# EAGLE schematic STM32 control board (EAGLE 9.6.1)

## Sheet 1 of 2
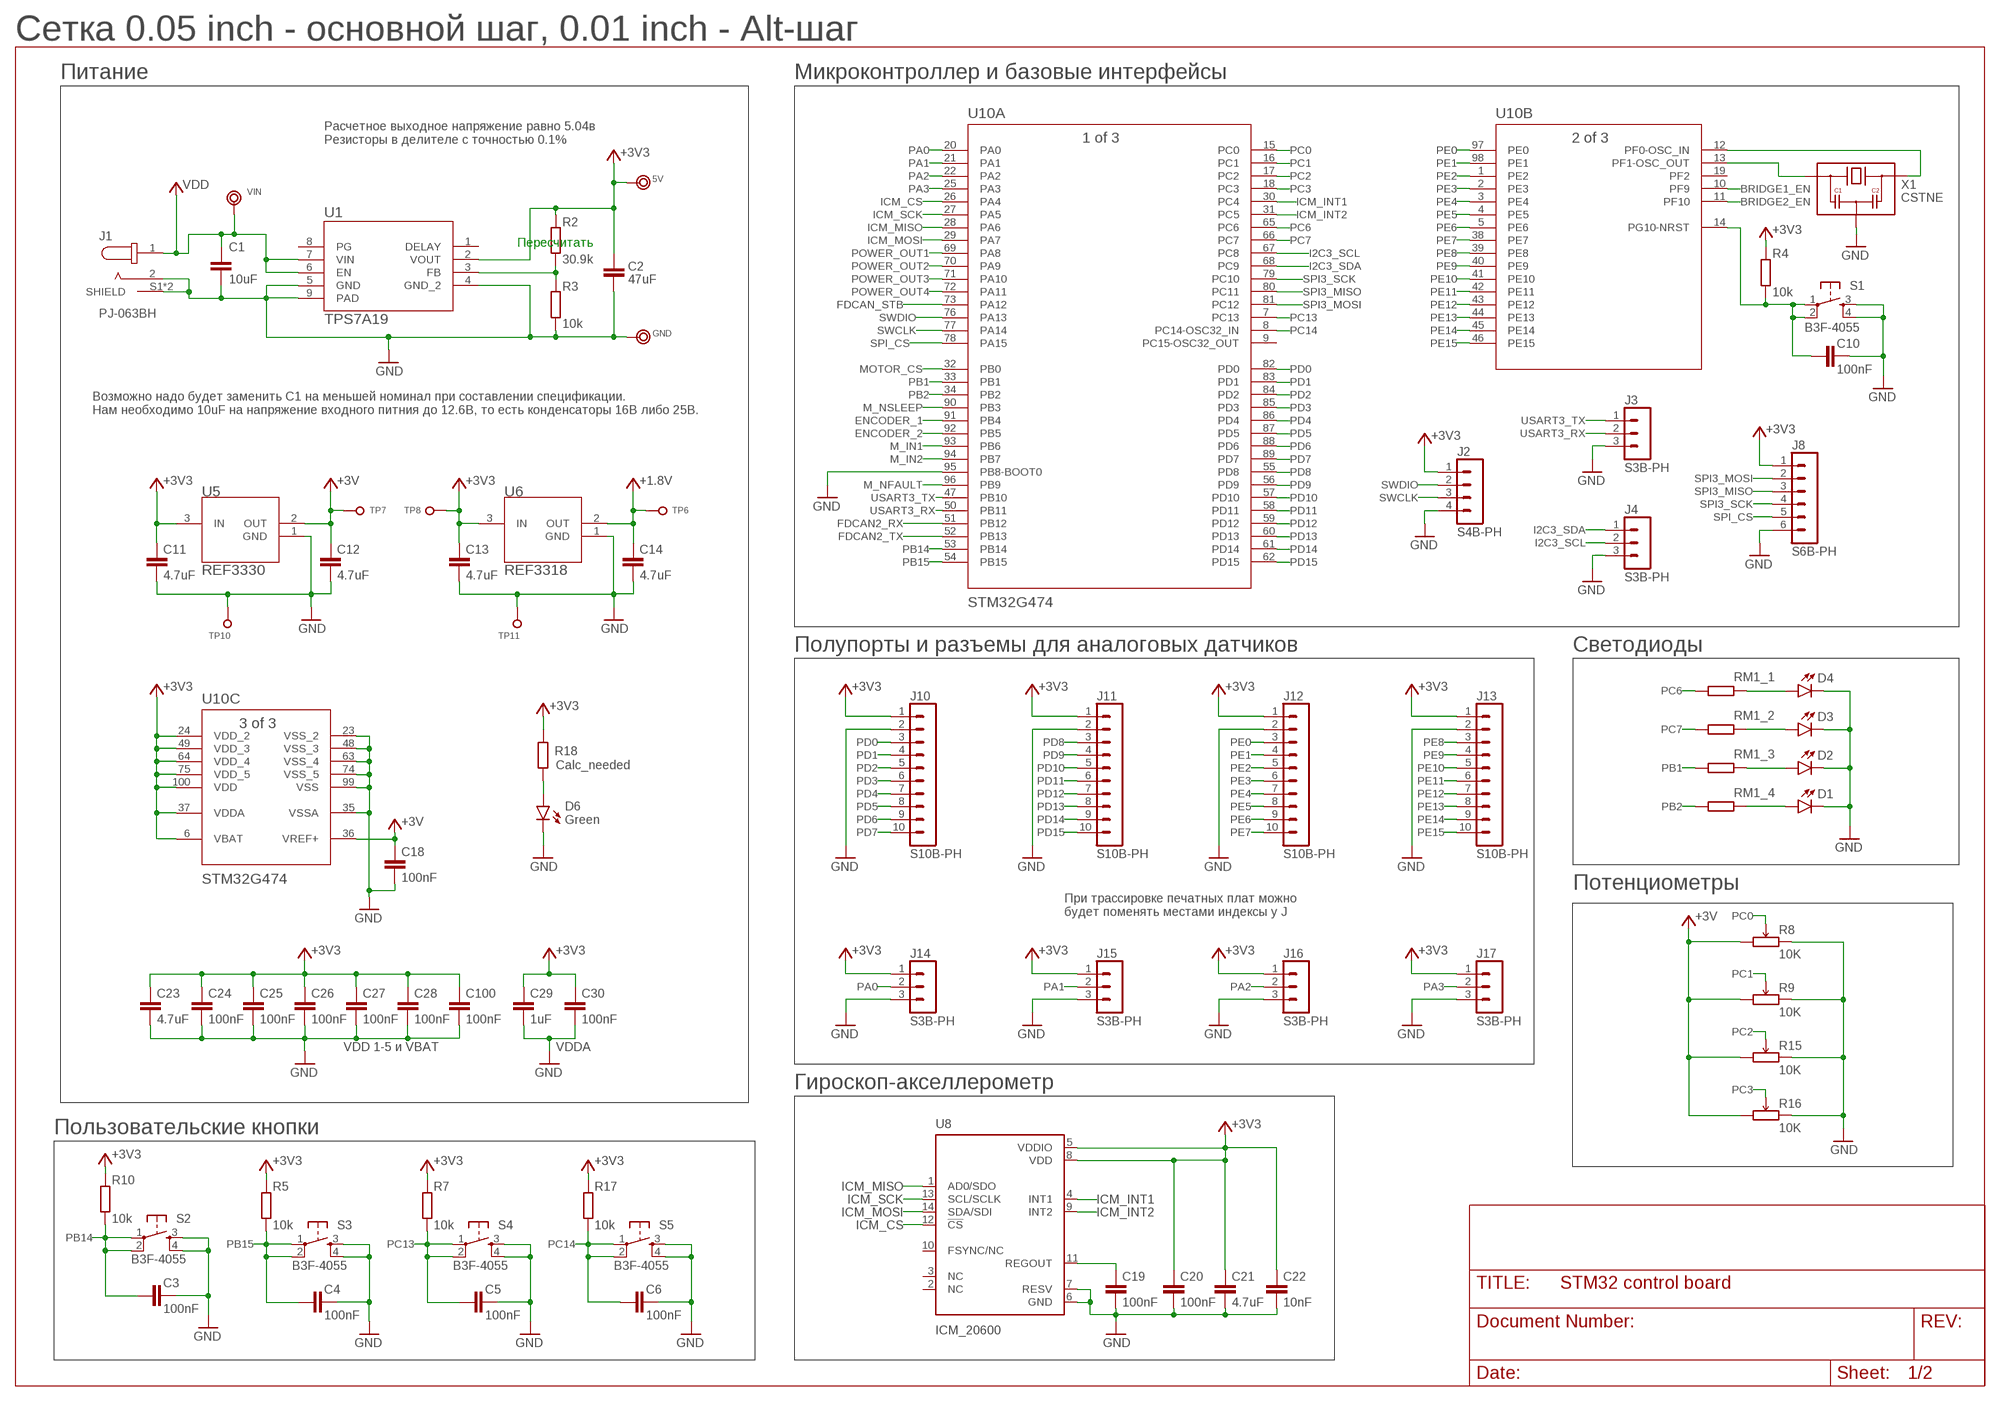
[diagram p0: schematic, sheet 1]

### Parts
5V  TEST_RING  [TEST_RING]
C1  10uF  C-EU-CERAMIC1206  [C1206]
C2  47uF  C-EU-CERAMIC1210  [C1210]
C3  100nF  C-EU-CERAMIC0402  [C0402]
C4  100nF  C-EU-CERAMIC0402  [C0402]
C5  100nF  C-EU-CERAMIC0402  [C0402]
C6  100nF  C-EU-CERAMIC0402  [C0402]
C10  100nF  C-EU-CERAMIC0402  [C0402]
C11  4.7uF  C-EU-CERAMIC0603  [C0603]
C12  4.7uF  C-EU-CERAMIC0603  [C0603]
C13  4.7uF  C-EU-CERAMIC0603  [C0603]
C14  4.7uF  C-EU-CERAMIC0603  [C0603]
C18  100nF  C-EU-CERAMIC0402  [C0402]
C19  100nF  C-EU-CERAMIC0402  [C0402]
C20  100nF  C-EU-CERAMIC0402  [C0402]
C21  4.7uF  C-EU-CERAMIC0603  [C0603]
C22  10nF  C-EU-CERAMIC0402  [C0402]
C23  4.7uF  C-EU-CERAMIC0603  [C0603]
C24  100nF  C-EU-CERAMIC0402  [C0402]
C25  100nF  C-EU-CERAMIC0402  [C0402]
C26  100nF  C-EU-CERAMIC0402  [C0402]
C27  100nF  C-EU-CERAMIC0402  [C0402]
C28  100nF  C-EU-CERAMIC0402  [C0402]
C29  1uF  C-EU-CERAMIC0402  [C0402]
C30  100nF  C-EU-CERAMIC0402  [C0402]
C100  100nF  C-EU-CERAMIC0402  [C0402]
D1  Blue  LED0805  [LED-0805]
D2  Blue  LED0805  [LED-0805]
D3  Blue  LED0805  [LED-0805]
D4  Blue  LED0805  [LED-0805]
D6  Green  LED0805  [LED-0805]
GND  TEST_RING  [TEST_RING]
J1  PJ-063BH  [CUI_PJ-063BH]
J2  S4B-PH  [S4B-PH-K]
J3  S3B-PH  [S3B-PH-K]
J4  S3B-PH  [S3B-PH-K]
J8  S6B-PH  [S6B-PH-K]
J10  S10B-PH  [S10B-PH-K]
J11  S10B-PH  [S10B-PH-K]
J12  S10B-PH  [S10B-PH-K]
J13  S10B-PH  [S10B-PH-K]
J14  S3B-PH  [S3B-PH-K]
J15  S3B-PH  [S3B-PH-K]
J16  S3B-PH  [S3B-PH-K]
J17  S3B-PH  [S3B-PH-K]
R2  30.9k  R-EU0402  [R0402]
R3  10k  R-EU0402  [R0402]
R4  10k  R-EU0402  [R0402]
R5  10k  R-EU0402  [R0402]
R7  10k  R-EU0402  [R0402]
R8  10K  POTEMTIOMETER_EU  [ALPS_PTM]
R9  10K  POTEMTIOMETER_EU  [ALPS_PTM]
R10  10k  R-EU0402  [R0402]
R15  10K  POTEMTIOMETER_EU  [ALPS_PTM]
R16  10K  POTEMTIOMETER_EU  [ALPS_PTM]
R17  10k  R-EU0402  [R0402]
R18  Calc_needed  R-EU0402  [R0402]
RM1  RES_ARRAY  [0603-ARC]
S1  B3F-4055  [SWITCH_B3F-4055]
S2  B3F-4055  [SWITCH_B3F-4055]
S3  B3F-4055  [SWITCH_B3F-4055]
S4  B3F-4055  [SWITCH_B3F-4055]
S5  B3F-4055  [SWITCH_B3F-4055]
TP6  1.8  TEST_PAD-[1.27MM_SK]  [TP1.27MM_MASK_SILKSCREEN]
TP7  3.0  TEST_PAD-[1.27MM_SK]  [TP1.27MM_MASK_SILKSCREEN]
TP8  3.3  TEST_PAD-[1.27MM_SK]  [TP1.27MM_MASK_SILKSCREEN]
TP10  TEST_PAD-[1.27MM_SK]  [TP1.27MM_MASK_SILKSCREEN]
TP11  TEST_PAD-[1.27MM_SK]  [TP1.27MM_MASK_SILKSCREEN]
U1  TPS7A19  TPS7A1901DRBT  [DRB0008B]
U5  REF3330  REF33  [SOT-23-3]
U6  REF3318  REF33  [SOT-23-3]
U8  ICM_20600  [14_PIN_LGA]
U10  STM32G474  STM32G4_LPQFP100  [LPQFP-100]
VIN  TEST_RING  [TEST_RING]
X1  CSTNE  [MURATA_SMD_3P]

### Nets
+1.8V: C14.1 TP6.1 U6.2(OUT) ; also sheet 2
+3V: C12.1 C18.1 R8.P$1 R9.P$1 R15.P$1 R16.P$1 TP7.1 U5.2(OUT) U10.36(C:VREF+)
+3V3: 5V.1 C2.1 C11.1 C13.1 C20.1 C21.1 C22.1 C23.1 C24.1 C25.1 C26.1 C27.1 C28.1 C29.1 C30.1 C100.1 J2.1 J8.1 J10.1 J11.1 J12.1 J13.1 J14.1 J15.1 J16.1 J17.1 R2.2 R4.1 R5.2 R7.2 R10.2 R17.2 R18.2 TP8.1 U1.2(VOUT) U5.3(IN) U6.3(IN) U8.5(VDDIO) U8.8(VDD) U10.6(C:VBAT) U10.24(C:VDD_2) U10.37(C:VDDA) U10.49(C:VDD_3) U10.64(C:VDD_4) U10.75(C:VDD_5) U10.100(C:VDD) ; also sheet 2
BRIDGE1_EN: U10.10(B:PF9) ; also sheet 2
BRIDGE2_EN: U10.11(B:PF10) ; also sheet 2
ENCODER_1: U10.91(A:PB4) ; also sheet 2
ENCODER_2: U10.92(A:PB5) ; also sheet 2
FDCAN2_RX: U10.51(A:PB12)
FDCAN2_TX: U10.52(A:PB13)
FDCAN_STB: U10.73(A:PA12)
GND: C1.2 C2.2 C3.2 C4.2 C5.2 C6.2 C10.2 C11.2 C12.2 C13.2 C14.2 C18.2 C19.2 C20.2 C21.2 C22.2 C23.2 C24.2 C25.2 C26.2 C27.2 C28.2 C29.2 C30.2 C100.2 D1.-(C) D2.-(C) D3.-(C) D4.-(C) D6.-(C) GND.1 J1.2 J1.S1(SHIELD) J1.S2(SHIELD) J2.4 J3.3 J4.3 J8.6 J10.2 J11.2 J12.2 J13.2 J14.3 J15.3 J16.3 J17.3 R3.1 R8.P$3 R9.P$3 R15.P$3 R16.P$3 S1.3 S1.4 S2.3 S2.4 S3.3 S3.4 S4.3 S4.4 S5.3 S5.4 TP10.1 TP11.1 U1.4(GND_2) U1.5(GND) U1.9(PAD) U5.1(GND) U6.1(GND) U8.6(GND) U8.7(RESV) U10.23(C:VSS_2) U10.35(C:VSSA) U10.48(C:VSS_3) U10.63(C:VSS_4) U10.74(C:VSS_5) U10.95(A:PB8-BOOT0) U10.99(C:VSS) X1.2(GND) ; also sheet 2
I2C3_SCL: J4.2 U10.67(A:PC8)
I2C3_SDA: J4.1 U10.68(A:PC9)
ICM_CS [ICM20600]: U8.12(!CS) U10.26(A:PA4)
ICM_INT1 [ICM20600]: U8.4(INT1) U10.30(A:PC4)
ICM_INT2 [ICM20600]: U8.9(INT2) U10.31(A:PC5)
ICM_MISO [ICM20600]: U8.1(AD0/SDO) U10.28(A:PA6)
ICM_MOSI [ICM20600]: U8.14(SDA/SDI) U10.29(A:PA7)
ICM_SCK [ICM20600]: U8.13(SCL/SCLK) U10.27(A:PA5)
M_IN1: U10.93(A:PB6) ; also sheet 2
M_IN2: U10.94(A:PB7) ; also sheet 2
M_NFAULT: U10.96(A:PB9) ; also sheet 2
M_NSLEEP: U10.90(A:PB3) ; also sheet 2
MOTOR_CS: U10.32(A:PB0) ; also sheet 2
N$1: U10.12(B:PF0-OSC_IN) X1.3(OUT)
N$2: U10.13(B:PF1-OSC_OUT) X1.1(IN)
N$4: D1.+(A) RM1.5
N$5: D2.+(A) RM1.6
N$6: D3.+(A) RM1.7
N$7: D6.+(A) R18.1
N$11: D4.+(A) RM1.8
N$21: R2.1 R3.2 U1.3(FB)
PA0: J14.2 U10.20(A:PA0)
PA1: J15.2 U10.21(A:PA1)
PA2: J16.2 U10.22(A:PA2)
PA3: J17.2 U10.25(A:PA3)
PB1: RM1.3 U10.33(A:PB1)
PB2: RM1.4 U10.34(A:PB2)
PB14: C3.1 R10.1 S2.1 S2.2 U10.53(A:PB14)
PB15: C4.1 R5.1 S3.1 S3.2 U10.54(A:PB15)
PC0: R8.P$2 U10.15(A:PC0)
PC1: R9.P$2 U10.16(A:PC1)
PC2: R15.P$2 U10.17(A:PC2)
PC3: R16.P$2 U10.18(A:PC3)
PC6: RM1.1 U10.65(A:PC6)
PC7: RM1.2 U10.66(A:PC7)
PC13: C5.1 R7.1 S4.1 S4.2 U10.7(A:PC13)
PC14: C6.1 R17.1 S5.1 S5.2 U10.8(A:PC14-OSC32_IN)
PD0: J10.3 U10.82(A:PD0)
PD1: J10.4 U10.83(A:PD1)
PD2: J10.5 U10.84(A:PD2)
PD3: J10.6 U10.85(A:PD3)
PD4: J10.7 U10.86(A:PD4)
PD5: J10.8 U10.87(A:PD5)
PD6: J10.9 U10.88(A:PD6)
PD7: J10.10 U10.89(A:PD7)
PD8: J11.3 U10.55(A:PD8)
PD9: J11.4 U10.56(A:PD9)
PD10: J11.5 U10.57(A:PD10)
PD11: J11.6 U10.58(A:PD11)
PD12: J11.7 U10.59(A:PD12)
PD13: J11.8 U10.60(A:PD13)
PD14: J11.9 U10.61(A:PD14)
PD15: J11.10 U10.62(A:PD15)
PE0: J12.3 U10.97(B:PE0)
PE1: J12.4 U10.98(B:PE1)
PE2: J12.5 U10.1(B:PE2)
PE3: J12.6 U10.2(B:PE3)
PE4: J12.7 U10.3(B:PE4)
PE5: J12.8 U10.4(B:PE5)
PE6: J12.9 U10.5(B:PE6)
PE7: J12.10 U10.38(B:PE7)
PE8: J13.3 U10.39(B:PE8)
PE9: J13.4 U10.40(B:PE9)
PE10: J13.5 U10.41(B:PE10)
PE11: J13.6 U10.42(B:PE11)
PE12: J13.7 U10.43(B:PE12)
PE13: J13.8 U10.44(B:PE13)
PE14: J13.9 U10.45(B:PE14)
PE15: J13.10 U10.46(B:PE15)
POWER_OUT1: U10.69(A:PA8) ; also sheet 2
POWER_OUT2: U10.70(A:PA9) ; also sheet 2
POWER_OUT3: U10.71(A:PA10) ; also sheet 2
POWER_OUT4: U10.72(A:PA11) ; also sheet 2
REG: C19.1 U8.11(REGOUT)
RST: C10.1 R4.2 S1.1 S1.2 U10.14(B:PG10-NRST)
SPI3_MISO: J8.3 U10.80(A:PC11)
SPI3_MOSI: J8.2 U10.81(A:PC12)
SPI3_SCK: J8.4 U10.79(A:PC10)
SPI_CS: J8.5 U10.78(A:PA15)
SWCLK: J2.3 U10.77(A:PA14)
SWDIO: J2.2 U10.76(A:PA13)
USART3_RX: J3.2 U10.50(A:PB11)
USART3_TX: J3.1 U10.47(A:PB10)
VDD: C1.1 J1.1 U1.6(EN) U1.7(VIN) VIN.1 ; also sheet 2
Unconnected: U1.1(DELAY) U1.8(PG) U8.2(NC) U8.3(NC) U8.10(FSYNC/NC) U10.9(A:PC15-OSC32_OUT) U10.19(B:PF2)

### Notes on the sheet
- Сетка 0.05 inch - основной шаг, 0.01 inch - Alt-шаг
- Питание | Микроконтроллер и базовые интерфейсы
- Расчетное выходное напряжение равно 5.04в
  Резисторы в делителе с точностью 0.1%
- Пересчитать
- Возможно надо будет заменить С1 на меньшей номинал при составлении спецификации. 
  Нам необходимо 10uF на напряжение входного питния до 12.6В, то есть конденсаторы 16В либо 25В.
- Полупорты и разъемы для аналоговых датчиков | Светодиоды
- Потенциометры
- При трассировке печатных плат можно
  будет поменять местами индексы у J
- VDD 1-5 и VBAT | VDDA
- Гироскоп-акселлерометр
- Пользовательские кнопки

## Sheet 2 of 2
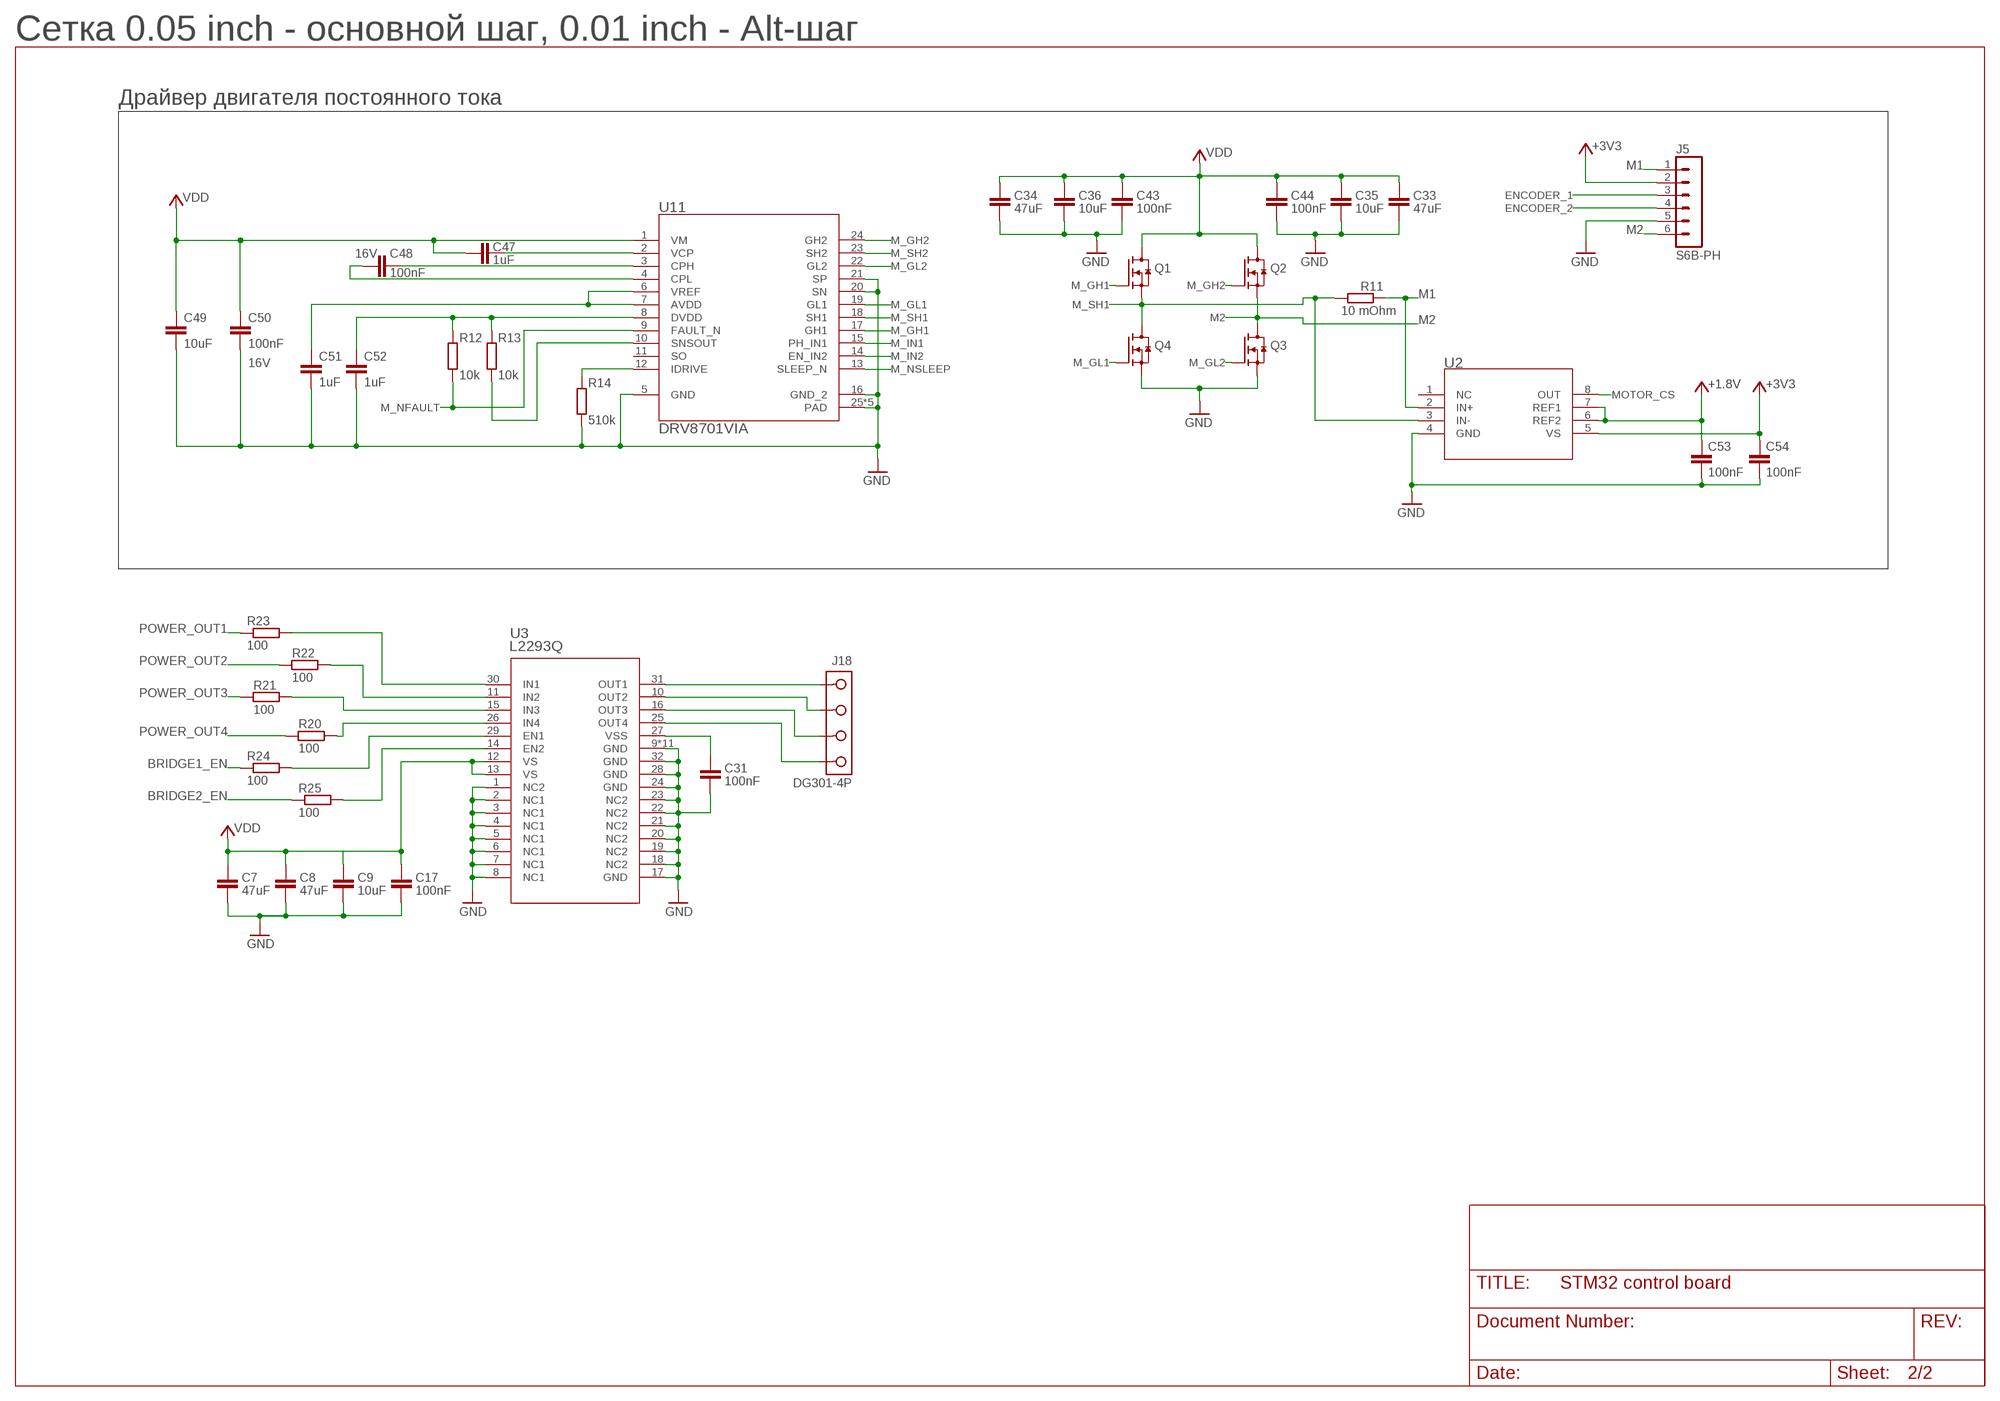
[diagram p1: schematic, sheet 2]

### Parts
C7  47uF  C-EU-CERAMIC1210  [C1210]
C8  47uF  C-EU-CERAMIC1210  [C1210]
C9  10uF  C-EU-CERAMIC1206  [C1206]
C17  100nF  C-EU-CERAMIC0402  [C0402]
C31  100nF  C-EU-CERAMIC0402  [C0402]
C33  47uF  C-EU-CERAMIC1210  [C1210]
C34  47uF  C-EU-CERAMIC1210  [C1210]
C35  10uF  C-EU-CERAMIC1206  [C1206]
C36  10uF  C-EU-CERAMIC1206  [C1206]
C43  100nF  C-EU-CERAMIC0603  [C0603]
C44  100nF  C-EU-CERAMIC0603  [C0603]
C47  1uF  C-EU-CERAMIC0603  [C0603]
C48  100nF  C-EU-CERAMIC0603  [C0603]
C49  10uF  C-EU-CERAMIC1206  [C1206]
C50  100nF  C-EU-CERAMIC0603  [C0603]
C51  1uF  C-EU-CERAMIC0402  [C0402]
C52  1uF  C-EU-CERAMIC0402  [C0402]
C53  100nF  C-EU-CERAMIC0402  [C0402]
C54  100nF  C-EU-CERAMIC0402  [C0402]
J5  S6B-PH  [S6B-PH-K]
J18  DG301-4P  [DG301-4P]
Q1  CSD15571Q2  [SON2X2]
Q2  CSD15571Q2  [SON2X2]
Q3  CSD15571Q2  [SON2X2]
Q4  CSD15571Q2  [SON2X2]
R11  10 mOhm  R_EU_CS  [CS_R0805]
R12  10k  R-EU0402  [R0402]
R13  10k  R-EU0402  [R0402]
R14  510k  R-EU0402  [R0402]
R20  100  R-EU0402  [R0402]
R21  100  R-EU0402  [R0402]
R22  100  R-EU0402  [R0402]
R23  100  R-EU0402  [R0402]
R24  100  R-EU0402  [R0402]
R25  100  R-EU0402  [R0402]
U2  INA240_TSSOP  [TSSOP-8]
U3  L2293Q  [QFN_293Q_STM]
U11  DRV8701VIA  [VQFN-24-VIA]

### Nets
+1.8V: C53.1 U2.6(REF2) U2.7(REF1) ; also sheet 1
+3V3: C54.1 J5.2 U2.5(VS) ; also sheet 1
AVDD1: C51.2 U11.6(VREF) U11.7(AVDD)
BRIDGE1_EN: R24.1 ; also sheet 1
BRIDGE2_EN: R25.1 ; also sheet 1
DRV2_SNSOUT: R13.1 U11.10(SNSOUT)
DVDD2: C52.2 R12.2 R13.2 U11.8(DVDD)
ENCODER_1: J5.3 ; also sheet 1
ENCODER_2: J5.4 ; also sheet 1
GND: C7.2 C8.2 C9.2 C17.2 C31.2 C33.2 C34.2 C35.2 C36.2 C43.2 C44.2 C49.2 C50.2 C51.1 C52.1 C53.2 C54.2 J5.5 Q3.S4(S) Q3.S8(S) Q4.S4(S) Q4.S8(S) R14.1 U2.4(GND) U3.1(NC2) U3.2(NC1) U3.3(NC1) U3.4(NC1) U3.5(NC1) U3.6(NC1) U3.7(NC1) U3.8(NC1) U3.9(GND) U3.17(GND) U3.18(NC2) U3.19(NC2) U3.20(NC2) U3.21(NC2) U3.22(NC2) U3.23(NC2) U3.24(GND) U3.28(GND) U3.32(GND) U3.P$1(GND) U3.P$2(GND) U3.P$3(GND) U3.P$4(GND) U3.P$5(GND) U3.P$6(GND) U3.P$7(GND) U3.P$8(GND) U3.P$9(GND) U3.PAD(GND) U11.5(GND) U11.16(GND_2) U11.20(SN) U11.21(SP) U11.25(PAD) U11.26(PAD) U11.27(PAD) U11.28(PAD) U11.29(PAD) ; also sheet 1
M1: J5.1 R11.2 U2.2(IN+)
M2: J5.6 Q2.S4(S) Q2.S8(S) Q3.D1(D) Q3.D2(D) Q3.D5(D) Q3.D6(D) Q3.D7(D)
M_GH1: Q1.G3(G) U11.17(GH1)
M_GH2: Q2.G3(G) U11.24(GH2)
M_GL1: Q4.G3(G) U11.19(GL1)
M_GL2: Q3.G3(G) U11.22(GL2)
M_IN1: U11.15(PH_IN1) ; also sheet 1
M_IN2: U11.14(EN_IN2) ; also sheet 1
M_NFAULT: R12.1 U11.9(FAULT_N) ; also sheet 1
M_NSLEEP: U11.13(SLEEP_N) ; also sheet 1
M_SH1: Q1.S4(S) Q1.S8(S) Q4.D1(D) Q4.D2(D) Q4.D5(D) Q4.D6(D) Q4.D7(D) R11.1 U2.3(IN-) U11.18(SH1)
M_SH2: U11.23(SH2)
MOTOR_CS: U2.8(OUT) ; also sheet 1
N$8: R23.2 U3.30(IN1)
N$15: R22.2 U3.11(IN2)
N$16: R21.2 U3.15(IN3)
N$17: C31.1 U3.27(VSS)
N$18: R20.2 U3.26(IN4)
N$19: R24.2 U3.29(EN1)
N$20: R25.2 U3.14(EN2)
N$24: C48.1 U11.3(CPH)
N$32: C48.2 U11.4(CPL)
N$33: C47.2 U11.2(VCP)
N$37: R14.2 U11.12(IDRIVE)
POUT1: J18.1 U3.31(OUT1)
POUT2: J18.2 U3.10(OUT2)
POUT3: J18.3 U3.16(OUT3)
POUT4: J18.4 U3.25(OUT4)
POWER_OUT1: R23.1 ; also sheet 1
POWER_OUT2: R22.1 ; also sheet 1
POWER_OUT3: R21.1 ; also sheet 1
POWER_OUT4: R20.1 ; also sheet 1
VDD: C7.1 C8.1 C9.1 C17.1 C33.1 C34.1 C35.1 C36.1 C43.1 C44.1 C47.1 C49.1 C50.1 Q1.D1(D) Q1.D2(D) Q1.D5(D) Q1.D6(D) Q1.D7(D) Q2.D1(D) Q2.D2(D) Q2.D5(D) Q2.D6(D) Q2.D7(D) U3.12(VS) U3.13(VS) U11.1(VM) ; also sheet 1
Unconnected: U2.1(NC) U11.11(SO)

### Notes on the sheet
- Сетка 0.05 inch - основной шаг, 0.01 inch - Alt-шаг
- Драйвер двигателя постоянного тока
- 16V
- 16V

## Library data of the parts
5V GND VIN = testing:TEST_RING: Test rings are used to fixing multimeter probe and doing measurements hands-free Updated: 02.01.2020 by Denis Yaskevich, denis.jaskevich@yandex.by
C1 C3-C6 C10-C14 C17-C31 C43 C44 C47-C54 C100 = Capacitors:C-EU-CERAMIC: MLCC footprints for reflow soldering According to https://docs.google.com/document/d/1dteNWmS3K0-mGsqeLvja9cdOfhO5witaUV6Y-umTd90/edit?usp=sharing Last edit 23.05.2020 by Denis Yaskevich, denis.jaskevich@yandex.by
C2 C7 C8 C33 C34 = Capacitors:C-EU-CERAMIC: MLCC footprints for reflow soldering According to https://docs.google.com/document/d/1dteNWmS3K0-mGsqeLvja9cdOfhO5witaUV6Y-umTd90/edit?usp=sharing Last edit 23.05.2020 by Denis Yaskevich, denis.jaskevich@yandex.by; MANUFACTURER_PART_NUMBER: GRM32ER61C476ME15L
C9 C35 C36 = Capacitors:C-EU-CERAMIC: MLCC footprints for reflow soldering According to https://docs.google.com/document/d/1dteNWmS3K0-mGsqeLvja9cdOfhO5witaUV6Y-umTd90/edit?usp=sharing Last edit 23.05.2020 by Denis Yaskevich, denis.jaskevich@yandex.by; MANUFACTURER_PART_NUMBER: CL31B106KOHNNNE
D1-D4 D6 = Semiconductor_devices:LED0805: LED Model suitable for all 0805 leds Updated: 22.10.19 by Andrey Dovnar, andrevdovnar@gmail.com
J1 = commonly used connectors:PJ-063BH: 2.5 mm Center Pin, 8.0 A, Right Angle, Through Hole, Shielded, Kinked Pins, Dc Power Jack Connector; MANUFACTURER: CUI INC; PARTREV: 1.02; STANDARD: Manufacturer recommendations
J2 = con-jst-ph:S4B-PH: Wire to board connector Model suitable for S4B-PH-K Updated: 21.10.19 by Andrey Dovnar, andrevdovnar@gmail.com
J3 J4 J14-J17 = con-jst-ph:S3B-PH: Wire to board connector Model suitable for S3B-PH-K Updated: 21.10.19 by Andrey Dovnar, andrevdovnar@gmail.com
J5 J8 = con-jst-ph:S6B-PH: Wire to board connector Model suitable for S6B-PH-K Updated: 21.10.19 by Andrey Dovnar, andrevdovnar@gmail.com
J10-J13 = con-jst-ph:S10B-PH: Wire to board connector Model suitable for S10B-PH-K Updated: 21.10.19 by Andrey Dovnar, andrevdovnar@gmail.com
J18 = Terminal blocks:DG301-4P
Q1-Q4 = Transistors:CSD15571Q2; MANUFACTURER_PART_NUMBER: CSD15571Q2
R2-R5 R7 R10 R12-R14 R17 R18 R20-R25 = Resistors:R-EU
R8 R9 R15 R16 = Resistors:POTEMTIOMETER_EU
R11 = Resistors:R_EU_CS; MANUFACTURER_PART_NUMBER: STE0805MW75R010F
RM1 = Resistors:RES_ARRAY
S1-S5 = buttons and switches:B3F-4055; BUILT_BY: EMA_Cory; COPYRIGHT: Copyright (C) 2018 Accelerated Designs. All rights reserved; MANUFACTURER_PART_NUMBER: B3F-4055; VENDOR: Omron
TP6-TP8 TP10 TP11 = testing:TEST_PAD: Test point SMD Updated: 05.11.19 by Andrey Dovnar, andrevdovnar@gmail.com
U1 = LDOs:TPS7A1901DRBT; BUILT_BY: EMA_UL_Team; COPYRIGHT: Copyright (C) 2018 Accelerated Designs. All rights reserved; MANUFACTURER_PART_NUMBER: TPS7A1901DRBT; VENDOR: Texas Instruments
U2 = Current sensing:INA240_TSSOP; MANUFACTURER_PART_NUMBER: INA240
U3 = Transistors drivers:L2293Q; MANUFACTURER_PART_NUMBER: L2293Q
U5 U6 = Voltage references:REF33
U8 = InvenSence:ICM_20600: 6-axis IMU Model suitable for ICM-20600 Created: 18.10.19 by Andrey Dovnar, andrevdovnar@gmail.com Updated: 16.11.19 by Andrey Dovnar, andrevdovnar@gmail.com
U10 = stmicroelectronics:STM32G4_LPQFP100; BUILT_BY: EMA_Jessica; COPYRIGHT: Copyright (C) 2016 Accelerated Designs. All rights reserved; MANUFACTURER_PART_NUMBER: STM32G4_LPQFP100_T1; VENDOR: STMicroelectronics
U11 = Transistors drivers:DRV8701: Suitable for TI DRV8701P/(E) : H - driver with 47V max Vin and external MOSFETs
X1 = resonators and oscillators:CSTNE: Ceramic Resonator with integrated load capacitors No external components required Model suitable for all Murata electronics resonators from CSTNE_G, CSTNE_V, CSTNE_VH3L and CSTNE_GH5L families Created: 16.11.19 by Andrey Dovnar, andrevdovnar@gmail.com

## Net classes
3 POWER: clearance 0.2 mm